# Altium project FIT_PM12_v1.1.PrjPcb (part 8 of 13)

## Sheet JTAG.SchDoc: FIT_PM12 board
size 420 x 297 mm; CheckedBy: G.Kasprowicz; Author: INR Moscow; CompanyName: WUT ISE; DrawnBy: M.Podgórski; Organization: WUT ISE; Address1: PW ISE; Address2: Nowowiejska 15/19 00-665 Warsaw; Address3: gkasprow@gmail.com; DocumentNumber: 25; Revision: 2; SheetNumber: 23; SheetTotal: 34; ModifiedBy: -; CheckedDate: -; Title2: JTAG; DivGrp: WUT ISE; Designer: INR RAS; ModifiedDate: -; ProjectName: Sensor Box
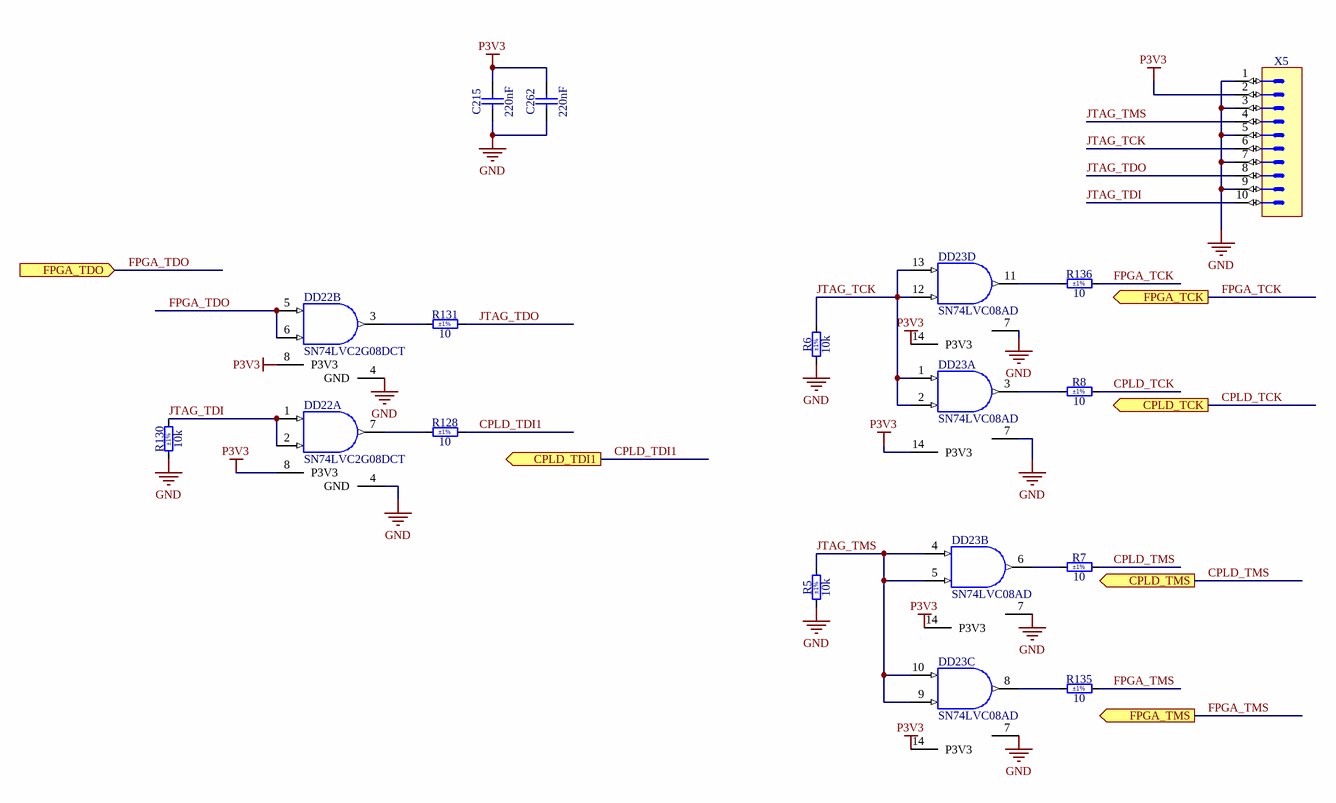
[diagram p25: JTAG.SchDoc]

### Parts
C215  220nF  [CAPC2012X135N]
C262  220nF  [CAPC2012X135N]
DD22  SN74LVC2G08DCT  [SOP65P400X130-8N]  (parts A,B of 2)
DD23  SN74LVC08AD  [SOIC127P600X175-14N]  (parts A,B,C,D of 4)
R5  10k  Tolerance: ±1%  [RESC2012X60N]
R6  10k  Tolerance: ±1%  [RESC2012X60N]
R7  10  Tolerance: ±1%  [RESC2012X70N]
R8  10  Tolerance: ±1%  [RESC2012X70N]
R128  10  Tolerance: ±1%  [RESC2012X70N]
R130  10k  Tolerance: ±1%  [RESC2012X60N]
R131  10  Tolerance: ±1%  [RESC2012X70N]
R135  10  Tolerance: ±1%  [RESC2012X70N]
R136  10  Tolerance: ±1%  [RESC2012X70N]
X5  (no value)  [CONNFLY_DS1014-10SF1B-B]

### Ports
CPLD_TCK (out), CPLD_TDI1 (out), CPLD_TMS (out), FPGA_TCK (out), FPGA_TDO (in), FPGA_TMS (out)

### Nets
GND: C215.1 C262.1 DD22.4(GND) DD23.7(GND) R5.1 R6.1 R130.1 X5.1 X5.3 X5.5 X5.7 X5.9
P3V3: C215.2 C262.2 DD22.8(P3V3) DD23.14(P3V3) X5.2  [also labelled VCC]
CPLD_TCK: R8.2 ; port CPLD_TCK
CPLD_TDI1: R128.2 ; port CPLD_TDI1  [project net CPLD_TDI]
CPLD_TMS: R7.2 ; port CPLD_TMS
FPGA_TCK: R136.2 ; port FPGA_TCK
FPGA_TDO: DD22.5(A) DD22.6(B) ; port FPGA_TDO
FPGA_TMS: R135.2 ; port FPGA_TMS
JTAG_TCK: DD23.1(A) DD23.2(B) DD23.12(B) DD23.13(A) R6.2 X5.6
JTAG_TDI: DD22.1(A) DD22.2(B) R130.2 X5.10
JTAG_TDO: R131.2 X5.8
JTAG_TMS: DD23.4(A) DD23.5(B) DD23.9(B) DD23.10(A) R5.2 X5.4
NetDD22_3: DD22.3(Y) R131.1
NetDD22_7: DD22.7(Y) R128.1
NetDD23_3: DD23.3(Y) R8.1
NetDD23_6: DD23.6(Y) R7.1
NetDD23_8: DD23.8(Y) R135.1
NetDD23_11: DD23.11(Y) R136.1

### Notes on the sheet
- Project/Equipment
- Document
- Designer
- Drawn by
- Check.by
- Copyright WUT ISE 2024.
  This documentation describes Open Hardware and is licensed under the CERN OHL v.2. You may redistribute and modify this documentation under the terms of the CERN OHL v.2. (http://ohwr.org/CERNOHL). This documentation is distributed WITHOUT ANY EXPRESS OR IMPLIED WARRANTY, INCLUDING OF MERCHANTABILITY, SATISFACTORY QUALITY AND FITNESS FOR A PARTICULAR PURPOSE. Please see the CERN OHL v.2 for applicable conditions.
- Contact
- File
- Last Mod.
- Print Date
- Sheet
- Size
- A3
- of
- Rev

### Library data of the parts
C215 C262 = CC0805_220NF_50V_10%_X7R: Non-polarised capacitor; Part Description: SMD Multilayer Chip Ceramic Capacitor; Manufacturer: GENERIC; Manufacturer1 Part Number: GRM21BR71H224KA01L; Voltage: 50V; TC: X7R; Tolerance: ±10%; Part Number: CC0805_220NF_50V_10%_X7R; Component Kind: Standard; Component Type: Standard; Pin Count: 2; Value: 220nF; Status: Preferred; Manufacturer Part Number: CC0805_220NF_50V_10%_X7R; Case: 0805; Mounted: Yes; Socket: No; SMD: Yes; Sense: No; Manufacturer1 Example: MURATA; Manufacturer1 ComponentHeight: 1.35mm; HelpURL: \\cern.ch\dfs\Applications\Altium\Datasheets\CC0805_X7R_MURATA.pdf; Author: CERN DEM JLC; CreateDate: 03.12.2007; LatestRevisionDate: 03.12.2007
DD22 = SN74LVC2G08DCT: Dual 2-Input Positive AND Gate; Part Description: Dual 2-Input Positive-AND Gate; Manufacturer: TEXAS INSTRUMENTS; PressFit: No; Bonding: No; Part Number: SN74LVC2G08DCT; Component Kind: Standard; Component Type: Standard; Device: SN74LVC2G08DCT; PackageDescription: SOP, 0.65mm Pitch; 8 Pin, 2.80mm W X 2.95mm L X 1.30mm H body, IPC Medium Density; Manufacturer Part Number: SN74LVC2G08DCT; Pin Count: 8; Case: TSSOP8; Mounted: Yes; Socket: No; SMD: Yes; Sense: No; ComponentHeight: 1.3mm; Author: CERN DEM MR; HelpURL: \\cern.ch\dfs\Applications\Altium\Datasheets\SN74LVC2G08DCT.pdf; CreateDate: 10.03.2017; LatestRevisionDate: 10.03.2017
DD23 = SN74LVC08AD: Quad 2-Input AND Gate; Part Description: Quadruple 2-Input Positive-AND Gate; Manufacturer: TEXAS INSTRUMENTS; PressFit: No; Bonding: No; Part Number: SN74LVC08AD; Component Kind: Standard; Component Type: Standard; Device: SN74LVC08AD; PackageDescription: SOIC 14, Pitch 1.27mm - Body 4x8.75mm, IPC Medium Density; Manufacturer Part Number: SN74LVC08AD; Pin Count: 14; Case: SOIC14; Mounted: Yes; Socket: No; SMD: Yes; Sense: No; ComponentHeight: 1.75mm; Author: CERN DEM JLC; HelpURL: \\cern.ch\dfs\Applications\Altium\Datasheets\SN74LVC08AD.pdf; CreateDate: 21.03.2012; LatestRevisionDate: 21.03.2012
R5 R6 R130 = R0805_10K_1%_0.125W_100PPM: Resistor - 1%; Part Description: General Purpose Thick Film Chip Resistor; Manufacturer: GENERIC; Manufacturer1 Part Number: NRC10F1002TRF; Power: 0.125W; TC: ±100ppm/°C; PressFit: No; Part Number: R0805_10K_1%_0.125W_100PPM; Component Kind: Standard; Component Type: Standard; Pin Count: 2; Value: 10k; Status: Preferred; Manufacturer Part Number: R0805_10K_1%_0.125W_100PPM; Case: 0805; Mounted: Yes; Sense: No; Socket: No; SMD: Yes; Manufacturer1 Example: NIC COMPONENT; Manufacturer1 ComponentHeight: 0.6mm; HelpURL: \\cern.ch\dfs\Applications\Altium\Datasheets\R0805_NIC_NRC.pdf; Author: CERN DEM JLC; CreateDate: 03.12.2007; LatestRevisionDate: 13.03.2008
R7 R8 R128 R131 R135 R136 = R0805_10R_1%_0.125W_100PPM_PANASONIC_ERJ: Resistor - 1%; Part Description: Low Resistance Thick Film Chip Resistor; Manufacturer Part Number: ERJ6ENF10R0V; Power: 0.125W; TC: ±100ppm/°C; PressFit: No; Part Number: R0805_10R_1%_0.125W_100PPM_PANASONIC_ERJ; Component Kind: Standard; Component Type: Standard; Pin Count: 2; Value: 10; Status: None; Manufacturer: PANASONIC; Case: 0805; Mounted: Yes; Sense: No; Socket: No; SMD: Yes; ComponentHeight: 0.7mm; HelpURL: \\cern.ch\dfs\Applications\Altium\Datasheets\R0805_PANASONIC_ERJ6EN.pdf; Author: CERN DEM HF; CreateDate: 07.06.2024; LatestRevisionDate: 07.06.2024
X5 = CONNFLY_DS1014-10SF1B-B: Connector 10 Male; Part Description: 10 Contacts, 2.00mm Box Header V/T,R/A & SMT Type; PressFit: No; Part Number: CONNFLY_DS1014-10SF1B-B; Component Kind: Standard; Component Type: Standard; Pin Count: 10; Mounted: Yes; Socket: No; SMD: No; Sense: No; Status: None; Manufacturer: CONNFLY; Manufacturer Part Number: DS1014-10SF1B-B; ComponentHeight: 5.6mm; HelpURL: \\cern.ch\dfs\Applications\Altium\Datasheets\CONNFLY_DS1014-10SF1B-B.pdf; Author: CERN DEM HF; CreateDate: 29.05.2024; LatestRevisionDate: 29.05.2024

## Sheet FPGA_Power.SchDoc: FIT_PM12 board
size 420 x 297 mm; CheckedBy: G.Kasprowicz; Author: INR Moscow; CompanyName: WUT ISE; DrawnBy: M.Podgórski; Organization: WUT ISE; Address1: PW ISE; Address2: Nowowiejska 15/19 00-665 Warsaw; Address3: gkasprow@gmail.com; DocumentNumber: 26; Revision: 2; SheetNumber: 24; SheetTotal: 34; ModifiedBy: -; CheckedDate: -; Title2: FPGA PWR; DivGrp: WUT ISE; Designer: INR RAS; ModifiedDate: -; ProjectName: Sensor Box
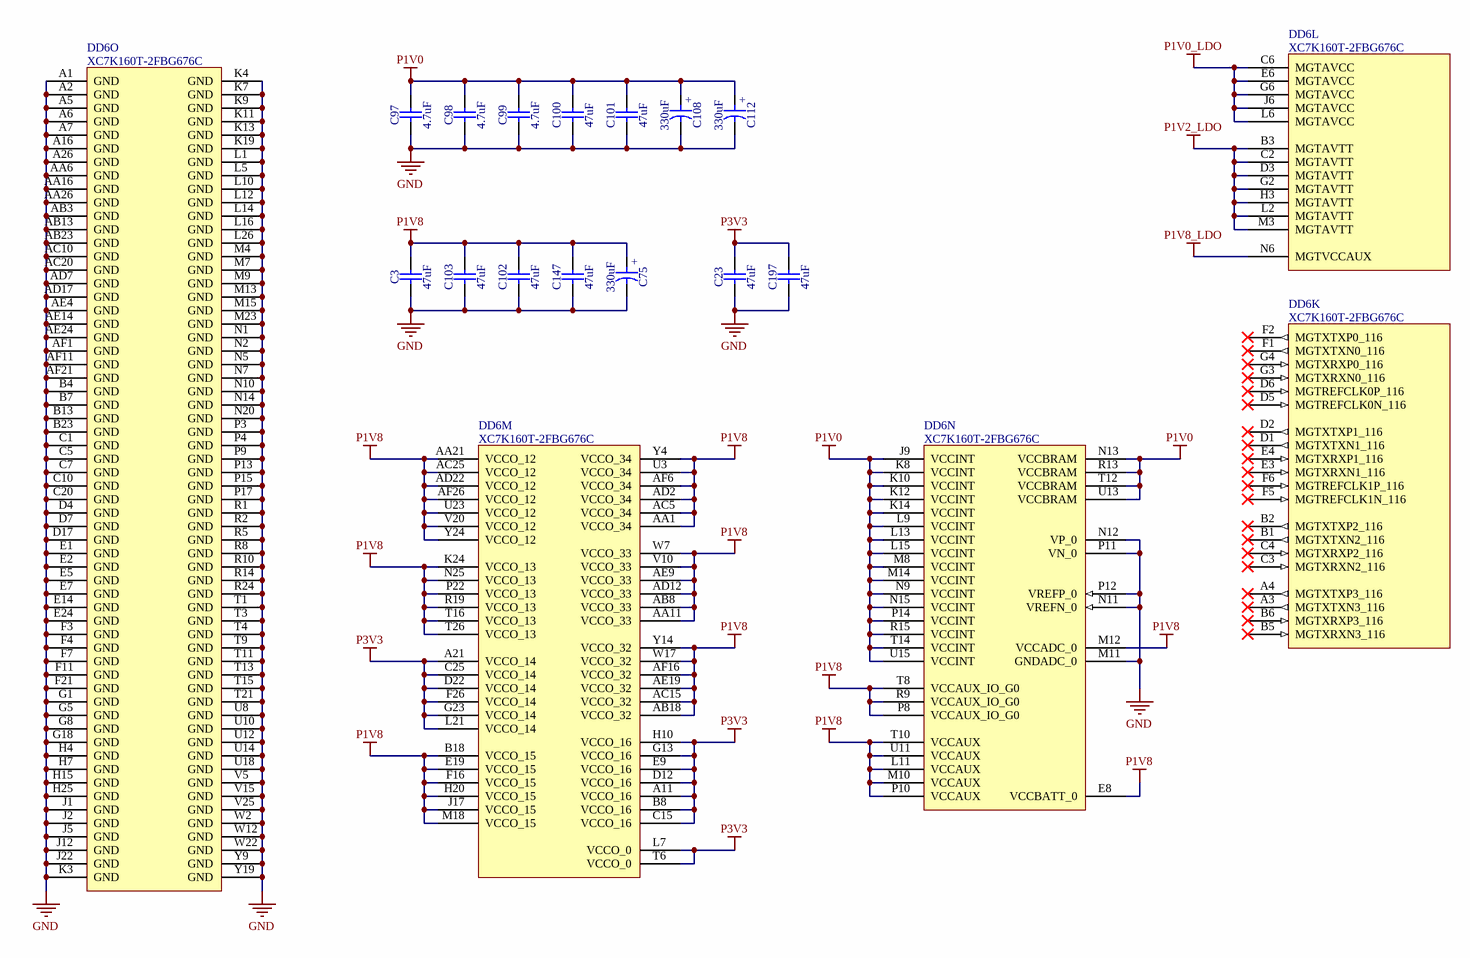
[diagram p26: FPGA_Power.SchDoc]

### Parts
C3  47uF  [CAPC3225X270N]
C23  47uF  [CAPC3225X270N]
C75  330uF  [CAPMP7343X300N]
C97  4.7uF  [CAPC2012X145N]
C98  4.7uF  [CAPC2012X145N]
C99  4.7uF  [CAPC2012X145N]
C100  47uF  [CAPC3225X270N]
C101  47uF  [CAPC3225X270N]
C102  47uF  [CAPC3225X270N]
C103  47uF  [CAPC3225X270N]
C108  330uF  [CAPMP7343X190N]
C112  330uF  [CAPMP7343X190N]
C147  47uF  [CAPC3225X270N]
C197  47uF  [CAPC3225X270N]
DD6  XC7K160T-2FBG676C  [BGA676C100P26X26_2700X2700X254]  (parts K,L,M,N,O of 15)

### Nets
GND: C3.1 C23.1 C75.2 C97.1 C98.1 C99.1 C100.1 C101.1 C102.1 C103.1 C108.2 C112.2 C147.1 C197.1 DD6.A1(GND) DD6.A2(GND) DD6.A5(GND) DD6.A6(GND) DD6.A7(GND) DD6.A16(GND) DD6.A26(GND) DD6.AA6(GND) DD6.AA16(GND) DD6.AA26(GND) DD6.AB3(GND) DD6.AB13(GND) DD6.AB23(GND) DD6.AC10(GND) DD6.AC20(GND) DD6.AD7(GND) DD6.AD17(GND) DD6.AE4(GND) DD6.AE14(GND) DD6.AE24(GND) DD6.AF1(GND) DD6.AF11(GND) DD6.AF21(GND) DD6.B4(GND) DD6.B7(GND) DD6.B13(GND) DD6.B23(GND) DD6.C1(GND) DD6.C5(GND) DD6.C7(GND) DD6.C10(GND) DD6.C20(GND) DD6.D4(GND) DD6.D7(GND) DD6.D17(GND) DD6.E1(GND) DD6.E2(GND) DD6.E5(GND) DD6.E7(GND) DD6.E14(GND) DD6.E24(GND) DD6.F3(GND) DD6.F4(GND) DD6.F7(GND) DD6.F11(GND) DD6.F21(GND) DD6.G1(GND) DD6.G5(GND) DD6.G8(GND) DD6.G18(GND) DD6.H4(GND) DD6.H7(GND) DD6.H15(GND) DD6.H25(GND) DD6.J1(GND) DD6.J2(GND) DD6.J5(GND) DD6.J12(GND) DD6.J22(GND) DD6.K3(GND) DD6.K4(GND) DD6.K7(GND) DD6.K9(GND) DD6.K11(GND) DD6.K13(GND) DD6.K19(GND) DD6.L1(GND) DD6.L5(GND) DD6.L10(GND) DD6.L12(GND) DD6.L14(GND) DD6.L16(GND) DD6.L26(GND) DD6.M4(GND) DD6.M7(GND) DD6.M9(GND) DD6.M11(GNDADC_0) DD6.M13(GND) DD6.M15(GND) DD6.M23(GND) DD6.N1(GND) DD6.N2(GND) DD6.N5(GND) DD6.N7(GND) DD6.N10(GND) DD6.N11(VREFN_0) DD6.N12(VP_0) DD6.N14(GND) DD6.N20(GND) DD6.P3(GND) DD6.P4(GND) DD6.P9(GND) DD6.P11(VN_0) DD6.P12(VREFP_0) DD6.P13(GND) DD6.P15(GND) DD6.P17(GND) DD6.R1(GND) DD6.R2(GND) DD6.R5(GND) DD6.R8(GND) DD6.R10(GND) DD6.R14(GND) DD6.R24(GND) DD6.T1(GND) DD6.T3(GND) DD6.T4(GND) DD6.T9(GND) DD6.T11(GND) DD6.T13(GND) DD6.T15(GND) DD6.T21(GND) DD6.U8(GND) DD6.U10(GND) DD6.U12(GND) DD6.U14(GND) DD6.U18(GND) DD6.V5(GND) DD6.V15(GND) DD6.V25(GND) DD6.W2(GND) DD6.W12(GND) DD6.W22(GND) DD6.Y9(GND) DD6.Y19(GND)
P1V0: C97.2 C98.2 C99.2 C100.2 C101.2 C108.1 C112.1 DD6.J9(VCCINT) DD6.K8(VCCINT) DD6.K10(VCCINT) DD6.K12(VCCINT) DD6.K14(VCCINT) DD6.L9(VCCINT) DD6.L13(VCCINT) DD6.L15(VCCINT) DD6.M8(VCCINT) DD6.M14(VCCINT) DD6.N9(VCCINT) DD6.N13(VCCBRAM) DD6.N15(VCCINT) DD6.P14(VCCINT) DD6.R13(VCCBRAM) DD6.R15(VCCINT) DD6.T12(VCCBRAM) DD6.T14(VCCINT) DD6.U13(VCCBRAM) DD6.U15(VCCINT)
P1V0_LDO: DD6.C6(MGTAVCC) DD6.E6(MGTAVCC) DD6.G6(MGTAVCC) DD6.J6(MGTAVCC) DD6.L6(MGTAVCC)
P1V2_LDO: DD6.B3(MGTAVTT) DD6.C2(MGTAVTT) DD6.D3(MGTAVTT) DD6.G2(MGTAVTT) DD6.H3(MGTAVTT) DD6.L2(MGTAVTT) DD6.M3(MGTAVTT)
P1V8: C3.2 C75.1 C102.2 C103.2 C147.2 DD6.AA1(VCCO_34) DD6.AA11(VCCO_33) DD6.AA21(VCCO_12) DD6.AB8(VCCO_33) DD6.AB18(VCCO_32) DD6.AC5(VCCO_34) DD6.AC15(VCCO_32) DD6.AC25(VCCO_12) DD6.AD2(VCCO_34) DD6.AD12(VCCO_33) DD6.AD22(VCCO_12) DD6.AE9(VCCO_33) DD6.AE19(VCCO_32) DD6.AF6(VCCO_34) DD6.AF16(VCCO_32) DD6.AF26(VCCO_12) DD6.B18(VCCO_15) DD6.E8(VCCBATT_0) DD6.E19(VCCO_15) DD6.F16(VCCO_15) DD6.H20(VCCO_15) DD6.J17(VCCO_15) DD6.K24(VCCO_13) DD6.L11(VCCAUX) DD6.M10(VCCAUX) DD6.M12(VCCADC_0) DD6.M18(VCCO_15) DD6.N25(VCCO_13) DD6.P8(VCCAUX_IO_G0) DD6.P10(VCCAUX) DD6.P22(VCCO_13) DD6.R9(VCCAUX_IO_G0) DD6.R19(VCCO_13) DD6.T8(VCCAUX_IO_G0) DD6.T10(VCCAUX) DD6.T16(VCCO_13) DD6.T26(VCCO_13) DD6.U3(VCCO_34) DD6.U11(VCCAUX) DD6.U23(VCCO_12) DD6.V10(VCCO_33) DD6.V20(VCCO_12) DD6.W7(VCCO_33) DD6.W17(VCCO_32) DD6.Y4(VCCO_34) DD6.Y14(VCCO_32) DD6.Y24(VCCO_12)
P1V8_LDO: DD6.N6(MGTVCCAUX)
P3V3: C23.2 C197.2 DD6.A11(VCCO_16) DD6.A21(VCCO_14) DD6.B8(VCCO_16) DD6.C15(VCCO_16) DD6.C25(VCCO_14) DD6.D12(VCCO_16) DD6.D22(VCCO_14) DD6.E9(VCCO_16) DD6.F26(VCCO_14) DD6.G13(VCCO_16) DD6.G23(VCCO_14) DD6.H10(VCCO_16) DD6.L7(VCCO_0) DD6.L21(VCCO_14) DD6.T6(VCCO_0)

Not connected (* = marked no-connect by the designer): DD6 A3(MGTXTXN3_116)* A4(MGTXTXP3_116)* B1(MGTXTXN2_116)* B2(MGTXTXP2_116)* B5(MGTXRXN3_116)* B6(MGTXRXP3_116)* C3(MGTXRXN2_116)* C4(MGTXRXP2_116)* D1(MGTXTXN1_116)* D2(MGTXTXP1_116)* D5(MGTREFCLK0N_116)* D6(MGTREFCLK0P_116)* E3(MGTXRXN1_116)* E4(MGTXRXP1_116)* F1(MGTXTXN0_116)* F2(MGTXTXP0_116)* F5(MGTREFCLK1N_116)* F6(MGTREFCLK1P_116)* G3(MGTXRXN0_116)* G4(MGTXRXP0_116)*

### Notes on the sheet
- Project/Equipment
- Document
- Designer
- Drawn by
- Check.by
- Copyright WUT ISE 2024.
  This documentation describes Open Hardware and is licensed under the CERN OHL v.2. You may redistribute and modify this documentation under the terms of the CERN OHL v.2. (http://ohwr.org/CERNOHL). This documentation is distributed WITHOUT ANY EXPRESS OR IMPLIED WARRANTY, INCLUDING OF MERCHANTABILITY, SATISFACTORY QUALITY AND FITNESS FOR A PARTICULAR PURPOSE. Please see the CERN OHL v.2 for applicable conditions.
- Contact
- File
- Last Mod.
- Print Date
- Sheet
- Size
- A3
- of
- Rev
- (in symbol CTE7343-19_330UF_2.5V_20%_LESR0009_KEMET_T520) +
- (in symbol CTE7343-30_330UF_4V_20%_PANASONIC_TPF) +

### Library data of the parts
C3 C23 C100-C103 C147 C197 = CC1210_47UF_16V_20%_X5R: Non-polarised capacitor; Part Description: SMD Multilayer Chip Ceramic Capacitor; Manufacturer: GENERIC; Manufacturer1 Part Number: EMK325BJ476MM-T; Voltage: 16V; TC: X5R; Tolerance: ±20%; Part Number: CC1210_47UF_16V_20%_X5R; Component Kind: Standard; Component Type: Standard; Pin Count: 2; Value: 47uF; Status: None; Manufacturer Part Number: CC1210_47UF_16V_20%_X5R; Case: 1210; Mounted: Yes; Socket: No; SMD: Yes; Sense: No; Manufacturer1 Example: TAIYO YUDEN; Manufacturer1 ComponentHeight: 2.7mm; HelpURL: \\cern.ch\dfs\Applications\Altium\Datasheets\CC1210_X5R_TAIYO-YUDEN_HIGH-VALUE.pdf; Author: CERN DEM MR; CreateDate: 03.02.2016; LatestRevisionDate: 03.02.2016
C75 = CTE7343-30_330UF_4V_20%_PANASONIC_TPF: Polarised capacitor; Part Description: ESR 0R009 Tantalum Chip Capacitor; Manufacturer Part Number: 4TPF330M9L; Voltage: 4V; Tolerance: ±20%; Part Number: CTE7343-30_330UF_4V_20%_PANASONIC_TPF; Component Kind: Standard; Component Type: Standard; Pin Count: 2; Value: 330uF; Status: None; Manufacturer: PANASONIC; Mounted: Yes; Socket: No; SMD: Yes; Sense: No; ComponentHeight: 3mm; HelpURL: \\cern.ch\dfs\Applications\Altium\Datasheets\CTE_PANASONIC_TPF.pdf; Author: CERN DEM HF; CreateDate: 30.05.2024; LatestRevisionDate: 30.05.2024
C97-C99 = CC0805_4.7UF_50V_10%_X7R: Non-polarised capacitor; Part Description: SMD Multilayer Chip Ceramic Capacitor; Manufacturer: GENERIC; Manufacturer1 Part Number: C2012X7R1H475K125; Voltage: 50V; TC: X7R; Tolerance: ±10%; Part Number: CC0805_4.7UF_50V_10%_X7R; Component Kind: Standard; Component Type: Standard; Pin Count: 2; Value: 4.7uF; Status: Preferred; Manufacturer Part Number: CC0805_4.7UF_50V_10%_X7R; Case: 0805; Mounted: Yes; Socket: No; SMD: Yes; Sense: No; Manufacturer1 Example: TDK; Manufacturer1 ComponentHeight: 1.45mm; HelpURL: \\cern.ch\dfs\Applications\Altium\Datasheets\CC0805_X7R_TDK_C.pdf; Author: CERN DEM JMW; CreateDate: 30.07.2021; LatestRevisionDate: 30.07.2021
C108 C112 = CTE7343-19_330UF_2.5V_20%_LESR0009_KEMET_T520: Polarised capacitor; Part Description: Low ESR 0R009 Tantalum Chip Capacitor; Manufacturer: KEMET; Manufacturer Part Number: T520V337M2R5ATE009; Voltage: 2.5V; Tolerance: ±20%; Part Number: CTE7343-19_330UF_2.5V_20%_LESR0009_KEMET_T520; Component Kind: Standard; Component Type: Standard; Pin Count: 2; Value: 330uF; Status: None; Case: V; Mounted: Yes; Socket: No; SMD: Yes; Sense: No; ComponentHeight: 1.9mm; HelpURL: \\cern.ch\dfs\Applications\Altium\Datasheets\CTE-LESR_KEMET_T520.pdf; Author: CERN DEM HF; CreateDate: 30.05.2024; LatestRevisionDate: 30.05.2024
DD6 = XC7K160T-2FBG676C: KINTEX-7, FPGA, 676-Ball BGA, Pb-Free; Part Description: KINTEX-7 FPGA, 162240 Logic Cells, 400 User I/O, 8 GTXs, 676-Ball BGA, Speed Grade 2, Commercial Grade, Pb-Free; Manufacturer: XILINX; PressFit: No; Bonding: No; Part Number: XC7K160T-2FBG676C; Component Kind: Standard; Component Type: Standard; Device: XC7K160T-2FBG676C; PackageDescription: BGA, 1.00mm Pitch, Square; 676 Pin, 26 Columns X 26 Rows, Body 27.0mm X 27.0mm X 2.54mm H, IPC Medium Density; Manufacturer Part Number: XC7K160T-2FBG676C; Pin Count: 676; Case: BGA676; Mounted: Yes; Socket: No; SMD: Yes; Sense: No; ComponentHeight: 2.54mm; HelpURL: \\cern.ch\dfs\Applications\Altium\Datasheets\XC7K160T-xFBG676C.pdf; ComponentLink1URL: \\cern.ch\dfs\Applications\Altium\Datasheets\XC7K160T-xFBG676C_Package-Pinout.pdf; ComponentLink1Description: Package/Pinout; Author: CERN DEM BC; CreateDate: 06.02.2020; LatestRevisionDate: 06.02.2020

## Sheet AFE.SchDoc: FIT_PM12 board
size 420 x 297 mm; CheckedBy: G.Kasprowicz; Author: INR Moscow; CompanyName: WUT ISE; DrawnBy: M.Podgórski; Organization: WUT ISE; Address1: PW ISE; Address2: Nowowiejska 15/19 00-665 Warsaw; Address3: gkasprow@gmail.com; DocumentNumber: 2; Revision: 2; SheetNumber: 6; SheetTotal: 34; ModifiedBy: -; CheckedDate: -; Title2: AFEs; DivGrp: WUT ISE; Designer: INR RAS; ModifiedDate: -; ProjectName: Sensor Box
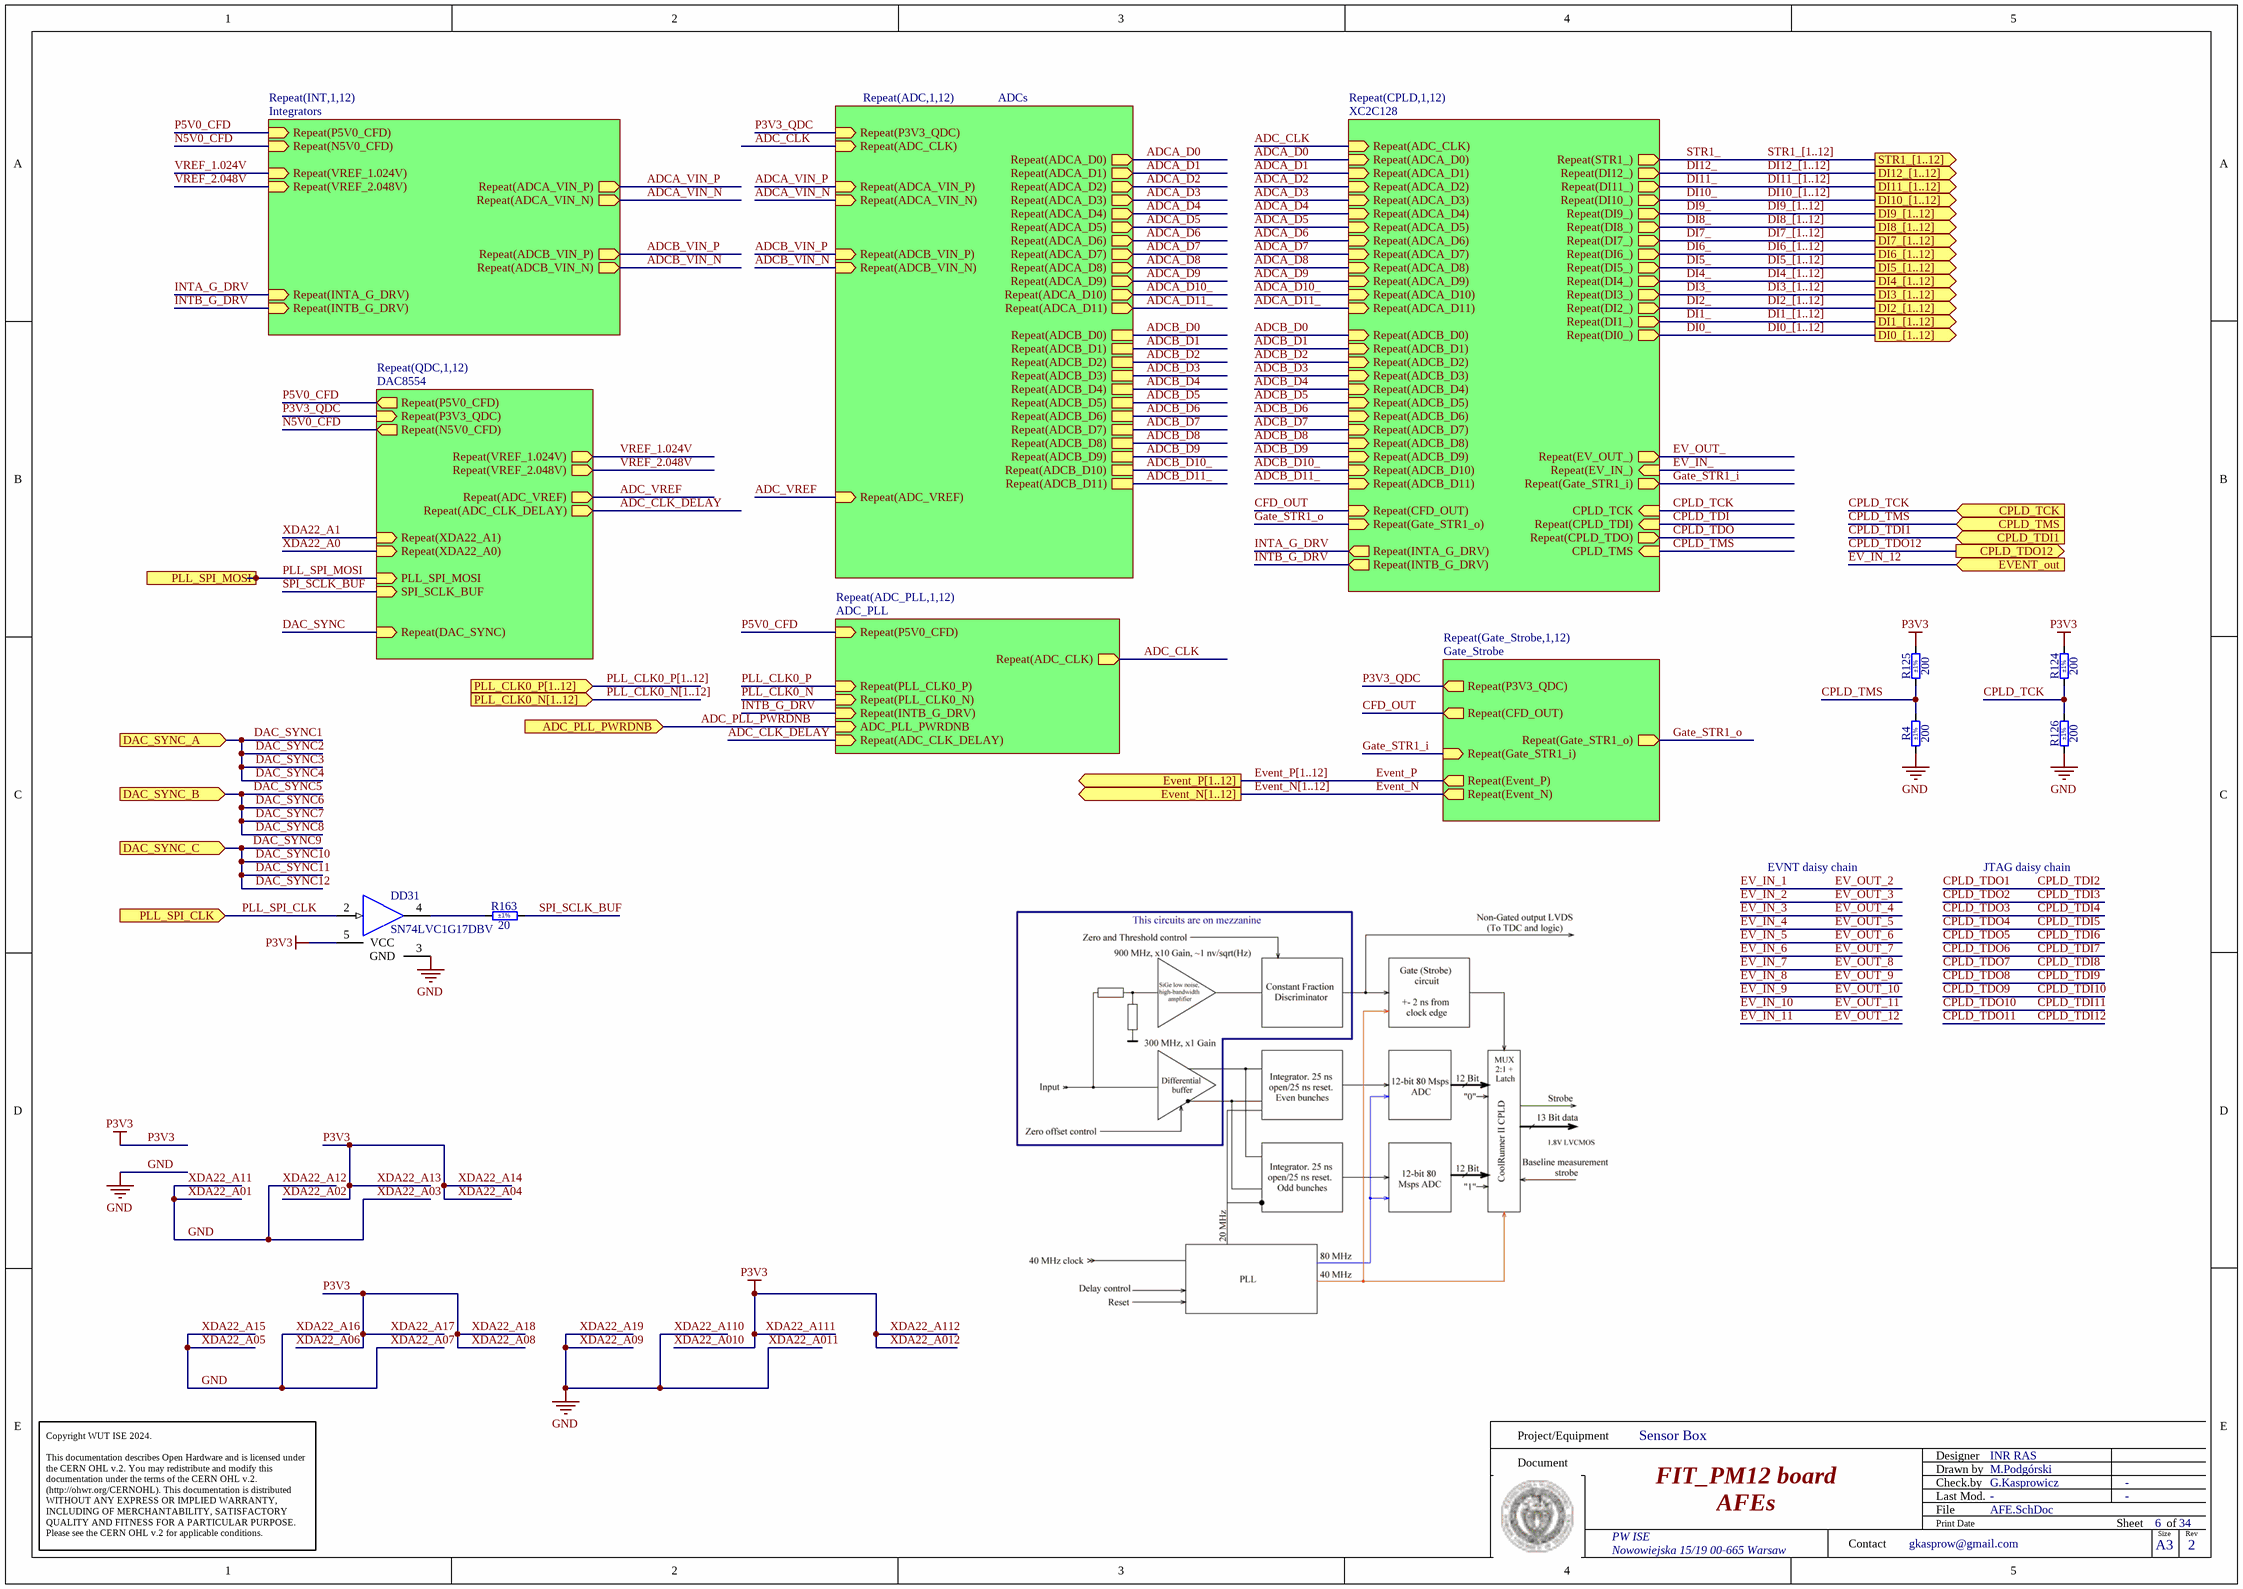
[diagram p27: AFE.SchDoc]

### Parts
(Parts that share a designator on the sheet are numbered #1, #2 ... from top to bottom, then left to right.)
DD31  SN74LVC1G17DBV  [SOT95P280X145-5N]
R4  200  Tolerance: ±1%  [RESC2012X60N]
R124#1  200  Tolerance: ±1%  [RESC2012X60N]
R125#1  200  Tolerance: ±1%  [RESC2012X60N]
R126#1  200  Tolerance: ±1%  [RESC2012X60N]
R163#1  20  Tolerance: ±1%  [RESC2012X60N]

### Sub-sheets
Repeat(ADC,1,12) = ADCs: Repeat(P3V3_QDC) (in), Repeat(ADCA_VIN_N) (in), Repeat(ADCA_VIN_P) (in), Repeat(ADC_VREF) (in), Repeat(ADCA_D6) (out), Repeat(ADCA_D5) (out), Repeat(ADCA_D4) (out), Repeat(ADCA_D3) (out), Repeat(ADCA_D2) (out), Repeat(ADCA_D1) (out), Repeat(ADCA_D0) (out), Repeat(ADCA_D8) (out), Repeat(ADCA_D7) (out), Repeat(ADCA_D10) (out), Repeat(ADCA_D9) (out), Repeat(ADCA_D11) (out), Repeat(ADCB_D11), Repeat(ADCB_D9), Repeat(ADCB_D8), Repeat(ADCB_D0), Repeat(ADCB_D1), Repeat(ADCB_D2), Repeat(ADCB_D3), Repeat(ADCB_D4), Repeat(ADCB_D5), Repeat(ADCB_D6), Repeat(ADCB_D7), Repeat(ADC_CLK) (in), Repeat(ADCB_VIN_N) (in), Repeat(ADCB_D10), Repeat(ADCB_VIN_P) (in)
Repeat(ADC_PLL,1,12) = ADC_PLL: Repeat(PLL_CLK0_P) (in), Repeat(PLL_CLK0_N) (in), ADC_PLL_PWRDNB (in), Repeat(ADC_CLK_DELAY) (in), Repeat(P5V0_CFD) (in), Repeat(ADC_CLK) (out), Repeat(INTB_G_DRV) (in)
Repeat(CPLD,1,12) = XC2C128: Repeat(INTA_G_DRV) (out), Repeat(INTB_G_DRV) (out), Repeat(ADC_CLK) (in), Repeat(Gate_STR1_i) (out), Repeat(Gate_STR1_o) (in), Repeat(CFD_OUT) (in), Repeat(CPLD_TDI) (in), Repeat(DI0_) (out), Repeat(DI1_) (out), Repeat(DI2_) (out), Repeat(DI3_) (out), Repeat(DI4_) (out), Repeat(DI5_) (out), Repeat(DI6_) (out), Repeat(DI7_) (out), Repeat(DI8_) (out), Repeat(STR1_) (out), Repeat(DI12_) (out), Repeat(DI11_) (out), Repeat(DI10_) (out), Repeat(DI9_) (out), Repeat(ADCA_D6) (in), Repeat(ADCA_D5) (in), Repeat(ADCA_D4) (in), Repeat(ADCA_D3) (in), Repeat(ADCA_D2) (in), Repeat(ADCA_D1) (in), Repeat(ADCA_D0) (in), Repeat(ADCB_D11) (in), Repeat(ADCB_D10) (in), Repeat(ADCB_D9) (in), Repeat(ADCB_D8) (in), Repeat(ADCA_D8) (in), Repeat(ADCA_D7) (in), Repeat(ADCA_D10) (in), Repeat(ADCA_D9) (in), Repeat(EV_OUT_) (out), Repeat(ADCA_D11) (in), Repeat(ADCB_D0) (in), Repeat(ADCB_D1) (in), Repeat(ADCB_D2) (in), Repeat(ADCB_D3) (in), Repeat(ADCB_D4) (in), Repeat(ADCB_D5) (in), Repeat(ADCB_D6) (in), Repeat(ADCB_D7) (in), Repeat(EV_IN_) (in), Repeat(CPLD_TDO) (out), CPLD_TCK (in), CPLD_TMS (in)
Repeat(Gate_Strobe,1,12) = Gate_Strobe: Repeat(Gate_STR1_i) (in), Repeat(Event_P) (out), Repeat(Event_N) (out), Repeat(P3V3_QDC) (out), Repeat(Gate_STR1_o) (out), Repeat(CFD_OUT) (out)
Repeat(INT,1,12) = Integrators: Repeat(N5V0_CFD) (in), Repeat(P5V0_CFD) (in), Repeat(INTA_G_DRV) (in), Repeat(INTB_G_DRV) (in), Repeat(VREF_2.048V) (in), Repeat(VREF_1.024V) (in), Repeat(ADCA_VIN_P) (out), Repeat(ADCA_VIN_N) (out), Repeat(ADCB_VIN_P) (out), Repeat(ADCB_VIN_N) (out)
Repeat(QDC,1,12) = DAC8554: Repeat(ADC_CLK_DELAY) (out), PLL_SPI_MOSI (in), SPI_SCLK_BUF (in), Repeat(DAC_SYNC) (in), Repeat(P5V0_CFD) (out), Repeat(N5V0_CFD) (out), Repeat(P3V3_QDC) (in), Repeat(VREF_2.048V) (out), Repeat(VREF_1.024V) (out), Repeat(ADC_VREF) (out), Repeat(XDA22_A1) (in), Repeat(XDA22_A0) (in)

### Ports
ADC_PLL_PWRDNB (in), CPLD_TCK (in), CPLD_TDI1 (in), CPLD_TDO12 (out), CPLD_TMS (in), DAC_SYNC_A (in), DAC_SYNC_B (in), DAC_SYNC_C (in), DI0_[1..12] (out), DI1_[1..12] (out), DI2_[1..12] (out), DI3_[1..12] (out), DI4_[1..12] (out), DI5_[1..12] (out), DI6_[1..12] (out), DI7_[1..12] (out), DI8_[1..12] (out), DI9_[1..12] (out), DI10_[1..12] (out), DI11_[1..12] (out), DI12_[1..12] (out), Event_N[1..12] (out), EVENT_out (in), Event_P[1..12] (out), PLL_CLK0_N[1..12] (in), PLL_CLK0_P[1..12] (in), PLL_SPI_CLK (in), PLL_SPI_MOSI (in), STR1_[1..12] (out)

### Nets
GND: DD31.3(GND) R4.1 R126#1.1  [also labelled XDA22_A01, XDA22_A011, XDA22_A03, XDA22_A05, XDA22_A07, XDA22_A09, XDA22_A11, XDA22_A110, XDA22_A12, XDA22_A15, XDA22_A16, XDA22_A19]
P3V3: DD31.5(VCC) R124#1.2 R125#1.2  [also labelled XDA22_A010, XDA22_A012, XDA22_A02, XDA22_A04, XDA22_A06, XDA22_A08, XDA22_A111, XDA22_A112, XDA22_A13, XDA22_A14, XDA22_A17, XDA22_A18]
ADC_CLK: sheet Repeat(ADC,1,12)/Repeat(ADC_CLK), sheet Repeat(CPLD,1,12)/Repeat(ADC_CLK), sheet Repeat(ADC_PLL,1,12)/Repeat(ADC_CLK)
ADC_CLK_DELAY: sheet Repeat(QDC,1,12)/Repeat(ADC_CLK_DELAY), sheet Repeat(ADC_PLL,1,12)/Repeat(ADC_CLK_DELAY)
ADC_PLL_PWRDNB: port ADC_PLL_PWRDNB, sheet Repeat(ADC_PLL,1,12)/ADC_PLL_PWRDNB
ADC_VREF: sheet Repeat(ADC,1,12)/Repeat(ADC_VREF), sheet Repeat(QDC,1,12)/Repeat(ADC_VREF)
ADCA_D0: sheet Repeat(ADC,1,12)/Repeat(ADCA_D0), sheet Repeat(CPLD,1,12)/Repeat(ADCA_D0)
ADCA_D1: sheet Repeat(ADC,1,12)/Repeat(ADCA_D1), sheet Repeat(CPLD,1,12)/Repeat(ADCA_D1)
ADCA_D2: sheet Repeat(ADC,1,12)/Repeat(ADCA_D2), sheet Repeat(CPLD,1,12)/Repeat(ADCA_D2)
ADCA_D3: sheet Repeat(ADC,1,12)/Repeat(ADCA_D3), sheet Repeat(CPLD,1,12)/Repeat(ADCA_D3)
ADCA_D4: sheet Repeat(ADC,1,12)/Repeat(ADCA_D4), sheet Repeat(CPLD,1,12)/Repeat(ADCA_D4)
ADCA_D5: sheet Repeat(ADC,1,12)/Repeat(ADCA_D5), sheet Repeat(CPLD,1,12)/Repeat(ADCA_D5)
ADCA_D6: sheet Repeat(ADC,1,12)/Repeat(ADCA_D6), sheet Repeat(CPLD,1,12)/Repeat(ADCA_D6)
ADCA_D7: sheet Repeat(ADC,1,12)/Repeat(ADCA_D7), sheet Repeat(CPLD,1,12)/Repeat(ADCA_D7)
ADCA_D8: sheet Repeat(ADC,1,12)/Repeat(ADCA_D8), sheet Repeat(CPLD,1,12)/Repeat(ADCA_D8)
ADCA_D9: sheet Repeat(ADC,1,12)/Repeat(ADCA_D9), sheet Repeat(CPLD,1,12)/Repeat(ADCA_D9)
ADCA_D10_: sheet Repeat(ADC,1,12)/Repeat(ADCA_D10), sheet Repeat(CPLD,1,12)/Repeat(ADCA_D10)
ADCA_D11_: sheet Repeat(ADC,1,12)/Repeat(ADCA_D11), sheet Repeat(CPLD,1,12)/Repeat(ADCA_D11)
ADCA_VIN_N: sheet Repeat(INT,1,12)/Repeat(ADCA_VIN_N), sheet Repeat(ADC,1,12)/Repeat(ADCA_VIN_N)
ADCA_VIN_P: sheet Repeat(INT,1,12)/Repeat(ADCA_VIN_P), sheet Repeat(ADC,1,12)/Repeat(ADCA_VIN_P)
ADCB_D0: sheet Repeat(ADC,1,12)/Repeat(ADCB_D0), sheet Repeat(CPLD,1,12)/Repeat(ADCB_D0)
ADCB_D1: sheet Repeat(ADC,1,12)/Repeat(ADCB_D1), sheet Repeat(CPLD,1,12)/Repeat(ADCB_D1)
ADCB_D2: sheet Repeat(ADC,1,12)/Repeat(ADCB_D2), sheet Repeat(CPLD,1,12)/Repeat(ADCB_D2)
ADCB_D3: sheet Repeat(ADC,1,12)/Repeat(ADCB_D3), sheet Repeat(CPLD,1,12)/Repeat(ADCB_D3)
ADCB_D4: sheet Repeat(ADC,1,12)/Repeat(ADCB_D4), sheet Repeat(CPLD,1,12)/Repeat(ADCB_D4)
ADCB_D5: sheet Repeat(ADC,1,12)/Repeat(ADCB_D5), sheet Repeat(CPLD,1,12)/Repeat(ADCB_D5)
ADCB_D6: sheet Repeat(ADC,1,12)/Repeat(ADCB_D6), sheet Repeat(CPLD,1,12)/Repeat(ADCB_D6)
ADCB_D7: sheet Repeat(ADC,1,12)/Repeat(ADCB_D7), sheet Repeat(CPLD,1,12)/Repeat(ADCB_D7)
ADCB_D8: sheet Repeat(ADC,1,12)/Repeat(ADCB_D8), sheet Repeat(CPLD,1,12)/Repeat(ADCB_D8)
ADCB_D9: sheet Repeat(ADC,1,12)/Repeat(ADCB_D9), sheet Repeat(CPLD,1,12)/Repeat(ADCB_D9)
ADCB_D10_: sheet Repeat(ADC,1,12)/Repeat(ADCB_D10), sheet Repeat(CPLD,1,12)/Repeat(ADCB_D10)
ADCB_D11_: sheet Repeat(ADC,1,12)/Repeat(ADCB_D11), sheet Repeat(CPLD,1,12)/Repeat(ADCB_D11)
ADCB_VIN_N: sheet Repeat(INT,1,12)/Repeat(ADCB_VIN_N), sheet Repeat(ADC,1,12)/Repeat(ADCB_VIN_N)
ADCB_VIN_P: sheet Repeat(INT,1,12)/Repeat(ADCB_VIN_P), sheet Repeat(ADC,1,12)/Repeat(ADCB_VIN_P)
CFD_OUT: sheet Repeat(CPLD,1,12)/Repeat(CFD_OUT), sheet Repeat(Gate_Strobe,1,12)/Repeat(CFD_OUT)
CPLD_TCK: R124#1.1 R126#1.2 ; port CPLD_TCK, sheet Repeat(CPLD,1,12)/CPLD_TCK
CPLD_TDI: sheet Repeat(CPLD,1,12)/Repeat(CPLD_TDI)
CPLD_TDO: sheet Repeat(CPLD,1,12)/Repeat(CPLD_TDO)
CPLD_TMS: R4.2 R125#1.1 ; port CPLD_TMS, sheet Repeat(CPLD,1,12)/CPLD_TMS
DAC_SYNC: sheet Repeat(QDC,1,12)/Repeat(DAC_SYNC)
DI0_: sheet Repeat(CPLD,1,12)/Repeat(DI0_)
DI1_: sheet Repeat(CPLD,1,12)/Repeat(DI1_)
DI2_: sheet Repeat(CPLD,1,12)/Repeat(DI2_)
DI3_: sheet Repeat(CPLD,1,12)/Repeat(DI3_)
DI4_: sheet Repeat(CPLD,1,12)/Repeat(DI4_)
DI5_: sheet Repeat(CPLD,1,12)/Repeat(DI5_)
DI6_: sheet Repeat(CPLD,1,12)/Repeat(DI6_)
DI7_: sheet Repeat(CPLD,1,12)/Repeat(DI7_)
DI8_: sheet Repeat(CPLD,1,12)/Repeat(DI8_)
DI9_: sheet Repeat(CPLD,1,12)/Repeat(DI9_)
DI10_: sheet Repeat(CPLD,1,12)/Repeat(DI10_)
DI11_: sheet Repeat(CPLD,1,12)/Repeat(DI11_)
DI12_: sheet Repeat(CPLD,1,12)/Repeat(DI12_)
EV_IN_: sheet Repeat(CPLD,1,12)/Repeat(EV_IN_)
EV_OUT_: sheet Repeat(CPLD,1,12)/Repeat(EV_OUT_)
Event_N: sheet Repeat(Gate_Strobe,1,12)/Repeat(Event_N)
Event_P: sheet Repeat(Gate_Strobe,1,12)/Repeat(Event_P)
Gate_STR1_i: sheet Repeat(CPLD,1,12)/Repeat(Gate_STR1_i), sheet Repeat(Gate_Strobe,1,12)/Repeat(Gate_STR1_i)
Gate_STR1_o: sheet Repeat(CPLD,1,12)/Repeat(Gate_STR1_o), sheet Repeat(Gate_Strobe,1,12)/Repeat(Gate_STR1_o)
INTA_G_DRV: sheet Repeat(INT,1,12)/Repeat(INTA_G_DRV), sheet Repeat(CPLD,1,12)/Repeat(INTA_G_DRV)
INTB_G_DRV: sheet Repeat(INT,1,12)/Repeat(INTB_G_DRV), sheet Repeat(CPLD,1,12)/Repeat(INTB_G_DRV), sheet Repeat(ADC_PLL,1,12)/Repeat(INTB_G_DRV)
N5V0_CFD: sheet Repeat(INT,1,12)/Repeat(N5V0_CFD), sheet Repeat(QDC,1,12)/Repeat(N5V0_CFD)
P3V3_QDC: sheet Repeat(ADC,1,12)/Repeat(P3V3_QDC), sheet Repeat(QDC,1,12)/Repeat(P3V3_QDC), sheet Repeat(Gate_Strobe,1,12)/Repeat(P3V3_QDC)
P5V0_CFD: sheet Repeat(INT,1,12)/Repeat(P5V0_CFD), sheet Repeat(QDC,1,12)/Repeat(P5V0_CFD), sheet Repeat(ADC_PLL,1,12)/Repeat(P5V0_CFD)
PLL_CLK0_N: sheet Repeat(ADC_PLL,1,12)/Repeat(PLL_CLK0_N)
PLL_CLK0_P: sheet Repeat(ADC_PLL,1,12)/Repeat(PLL_CLK0_P)
PLL_SPI_CLK: DD31.2(IN) ; port PLL_SPI_CLK
PLL_SPI_MOSI: port PLL_SPI_MOSI, sheet Repeat(QDC,1,12)/PLL_SPI_MOSI
SPI_SCLK_BUF: R163#1.2 ; sheet Repeat(QDC,1,12)/SPI_SCLK_BUF
STR1_: sheet Repeat(CPLD,1,12)/Repeat(STR1_)
VREF_1.024V: sheet Repeat(INT,1,12)/Repeat(VREF_1.024V), sheet Repeat(QDC,1,12)/Repeat(VREF_1.024V)
VREF_2.048V: sheet Repeat(INT,1,12)/Repeat(VREF_2.048V), sheet Repeat(QDC,1,12)/Repeat(VREF_2.048V)
XDA22_A0: sheet Repeat(QDC,1,12)/Repeat(XDA22_A0)
XDA22_A1: sheet Repeat(QDC,1,12)/Repeat(XDA22_A1)
NetDD31_4: DD31.4(OUT) R163#1.1

### Buses and harness runs
bus DI0_[1..12] = port DI0_[1..12]
bus DI1_[1..12] = port DI1_[1..12]
bus DI2_[1..12] = port DI2_[1..12]
bus DI3_[1..12] = port DI3_[1..12]
bus DI4_[1..12] = port DI4_[1..12]
bus DI5_[1..12] = port DI5_[1..12]
bus DI6_[1..12] = port DI6_[1..12]
bus DI7_[1..12] = port DI7_[1..12]
bus DI8_[1..12] = port DI8_[1..12]
bus DI9_[1..12] = port DI9_[1..12]
bus DI10_[1..12] = port DI10_[1..12]
bus DI11_[1..12] = port DI11_[1..12]
bus DI12_[1..12] = port DI12_[1..12]
bus Event_N[1..12] = port Event_N[1..12]
bus Event_P[1..12] = port Event_P[1..12]
bus PLL_CLK0_N[1..12] = port PLL_CLK0_N[1..12]
bus PLL_CLK0_P[1..12] = port PLL_CLK0_P[1..12]
bus STR1_[1..12] = port STR1_[1..12]

### Notes on the sheet
- EVNT daisy chain
- JTAG daisy chain
- Project/Equipment
- Document
- Designer
- Drawn by
- Check.by
- Copyright WUT ISE 2024.
  This documentation describes Open Hardware and is licensed under the CERN OHL v.2. You may redistribute and modify this documentation under the terms of the CERN OHL v.2. (http://ohwr.org/CERNOHL). This documentation is distributed WITHOUT ANY EXPRESS OR IMPLIED WARRANTY, INCLUDING OF MERCHANTABILITY, SATISFACTORY QUALITY AND FITNESS FOR A PARTICULAR PURPOSE. Please see the CERN OHL v.2 for applicable conditions.
- Contact
- File
- Last Mod.
- Print Date
- Sheet
- Size
- A3
- of
- Rev

### Library data of the parts
DD31 = SN74LVC1G17DBVR: Single Schmitt-Trigger Buffer; Manufacturer: TEXAS INSTRUMENTS; PressFit: No; Bonding: No; Part Number: SN74LVC1G17DBVR; Component Kind: Standard; Component Type: Standard; Device: SN74LVC1G17DBV; PackageDescription: SOT, 0.95mm Pitch; 5 Pin, 1.60mm W X 2.90mm L X 1.45mm H body, IPC Medium Density; Part Description: Single Schmitt-Trigger Buffer; Manufacturer Part Number: SN74LVC1G17DBV; Pin Count: 5; Case: SOT23-5; Mounted: Yes; Socket: No; SMD: Yes; Sense: No; ComponentHeight: 1.45mm; Author: CERN DEM JLC; HelpURL: \\cern.ch\dfs\Applications\Altium\Datasheets\SN74LVC1G17DBVR.pdf; CreateDate: 06.11.2012; LatestRevisionDate: 06.11.2012
R4 R124#1 R125#1 R126#1 = R0805_200R_1%_0.125W_100PPM: Resistor - 1%; Part Description: General Purpose Thick Film Chip Resistor; Manufacturer: GENERIC; Manufacturer1 Part Number: NRC10F2000TRF; Power: 0.125W; TC: ±100ppm/°C; PressFit: No; Part Number: R0805_200R_1%_0.125W_100PPM; Component Kind: Standard; Component Type: Standard; Pin Count: 2; Value: 200; Status: Preferred; Manufacturer Part Number: R0805_200R_1%_0.125W_100PPM; Case: 0805; Mounted: Yes; Sense: No; Socket: No; SMD: Yes; Manufacturer1 Example: NIC COMPONENT; Manufacturer1 ComponentHeight: 0.6mm; HelpURL: \\cern.ch\dfs\Applications\Altium\Datasheets\R0805_NIC_NRC.pdf; Author: CERN DEM JLC; CreateDate: 03.12.2007; LatestRevisionDate: 13.03.2008
R163#1 = R0805_20R_1%_0.125W_100PPM: Resistor - 1%; Part Description: General Purpose Thick Film Chip Resistor; Manufacturer: GENERIC; Manufacturer1 Part Number: NRC10F20R0TRF; Power: 0.125W; TC: ±100ppm/°C; PressFit: No; Part Number: R0805_20R_1%_0.125W_100PPM; Component Kind: Standard; Component Type: Standard; Pin Count: 2; Value: 20; Status: Preferred; Manufacturer Part Number: R0805_20R_1%_0.125W_100PPM; Case: 0805; Mounted: Yes; Sense: No; Socket: No; SMD: Yes; Manufacturer1 Example: NIC COMPONENT; Manufacturer1 ComponentHeight: 0.6mm; HelpURL: \\cern.ch\dfs\Applications\Altium\Datasheets\R0805_NIC_NRC.pdf; Author: CERN DEM JLC; CreateDate: 03.12.2007; LatestRevisionDate: 13.03.2008

## Sheet Integrators.SchDoc: FIT_PM12 board
size 420 x 297 mm; CheckedBy: G.Kasprowicz; Author: INR Moscow; CompanyName: WUT ISE; DrawnBy: M.Podgórski; Organization: WUT ISE; Address1: PW ISE; Address2: Nowowiejska 15/19 00-665 Warsaw; Address3: gkasprow@gmail.com; DocumentNumber: 3; Revision: 2; SheetNumber: 7; SheetTotal: 34; ModifiedBy: -; CheckedDate: -; Title2: Integrators; DivGrp: WUT ISE; Designer: INR RAS; ModifiedDate: -; ProjectName: Sensor Box
Used 12 times, as channels AFE/INT1, AFE/INT2, AFE/INT3, AFE/INT4, AFE/INT5, AFE/INT6, AFE/INT7, AFE/INT8, AFE/INT9, AFE/INT10, AFE/INT11, AFE/INT12. Parts and nets are listed once, with the designators drawn on the sheet.
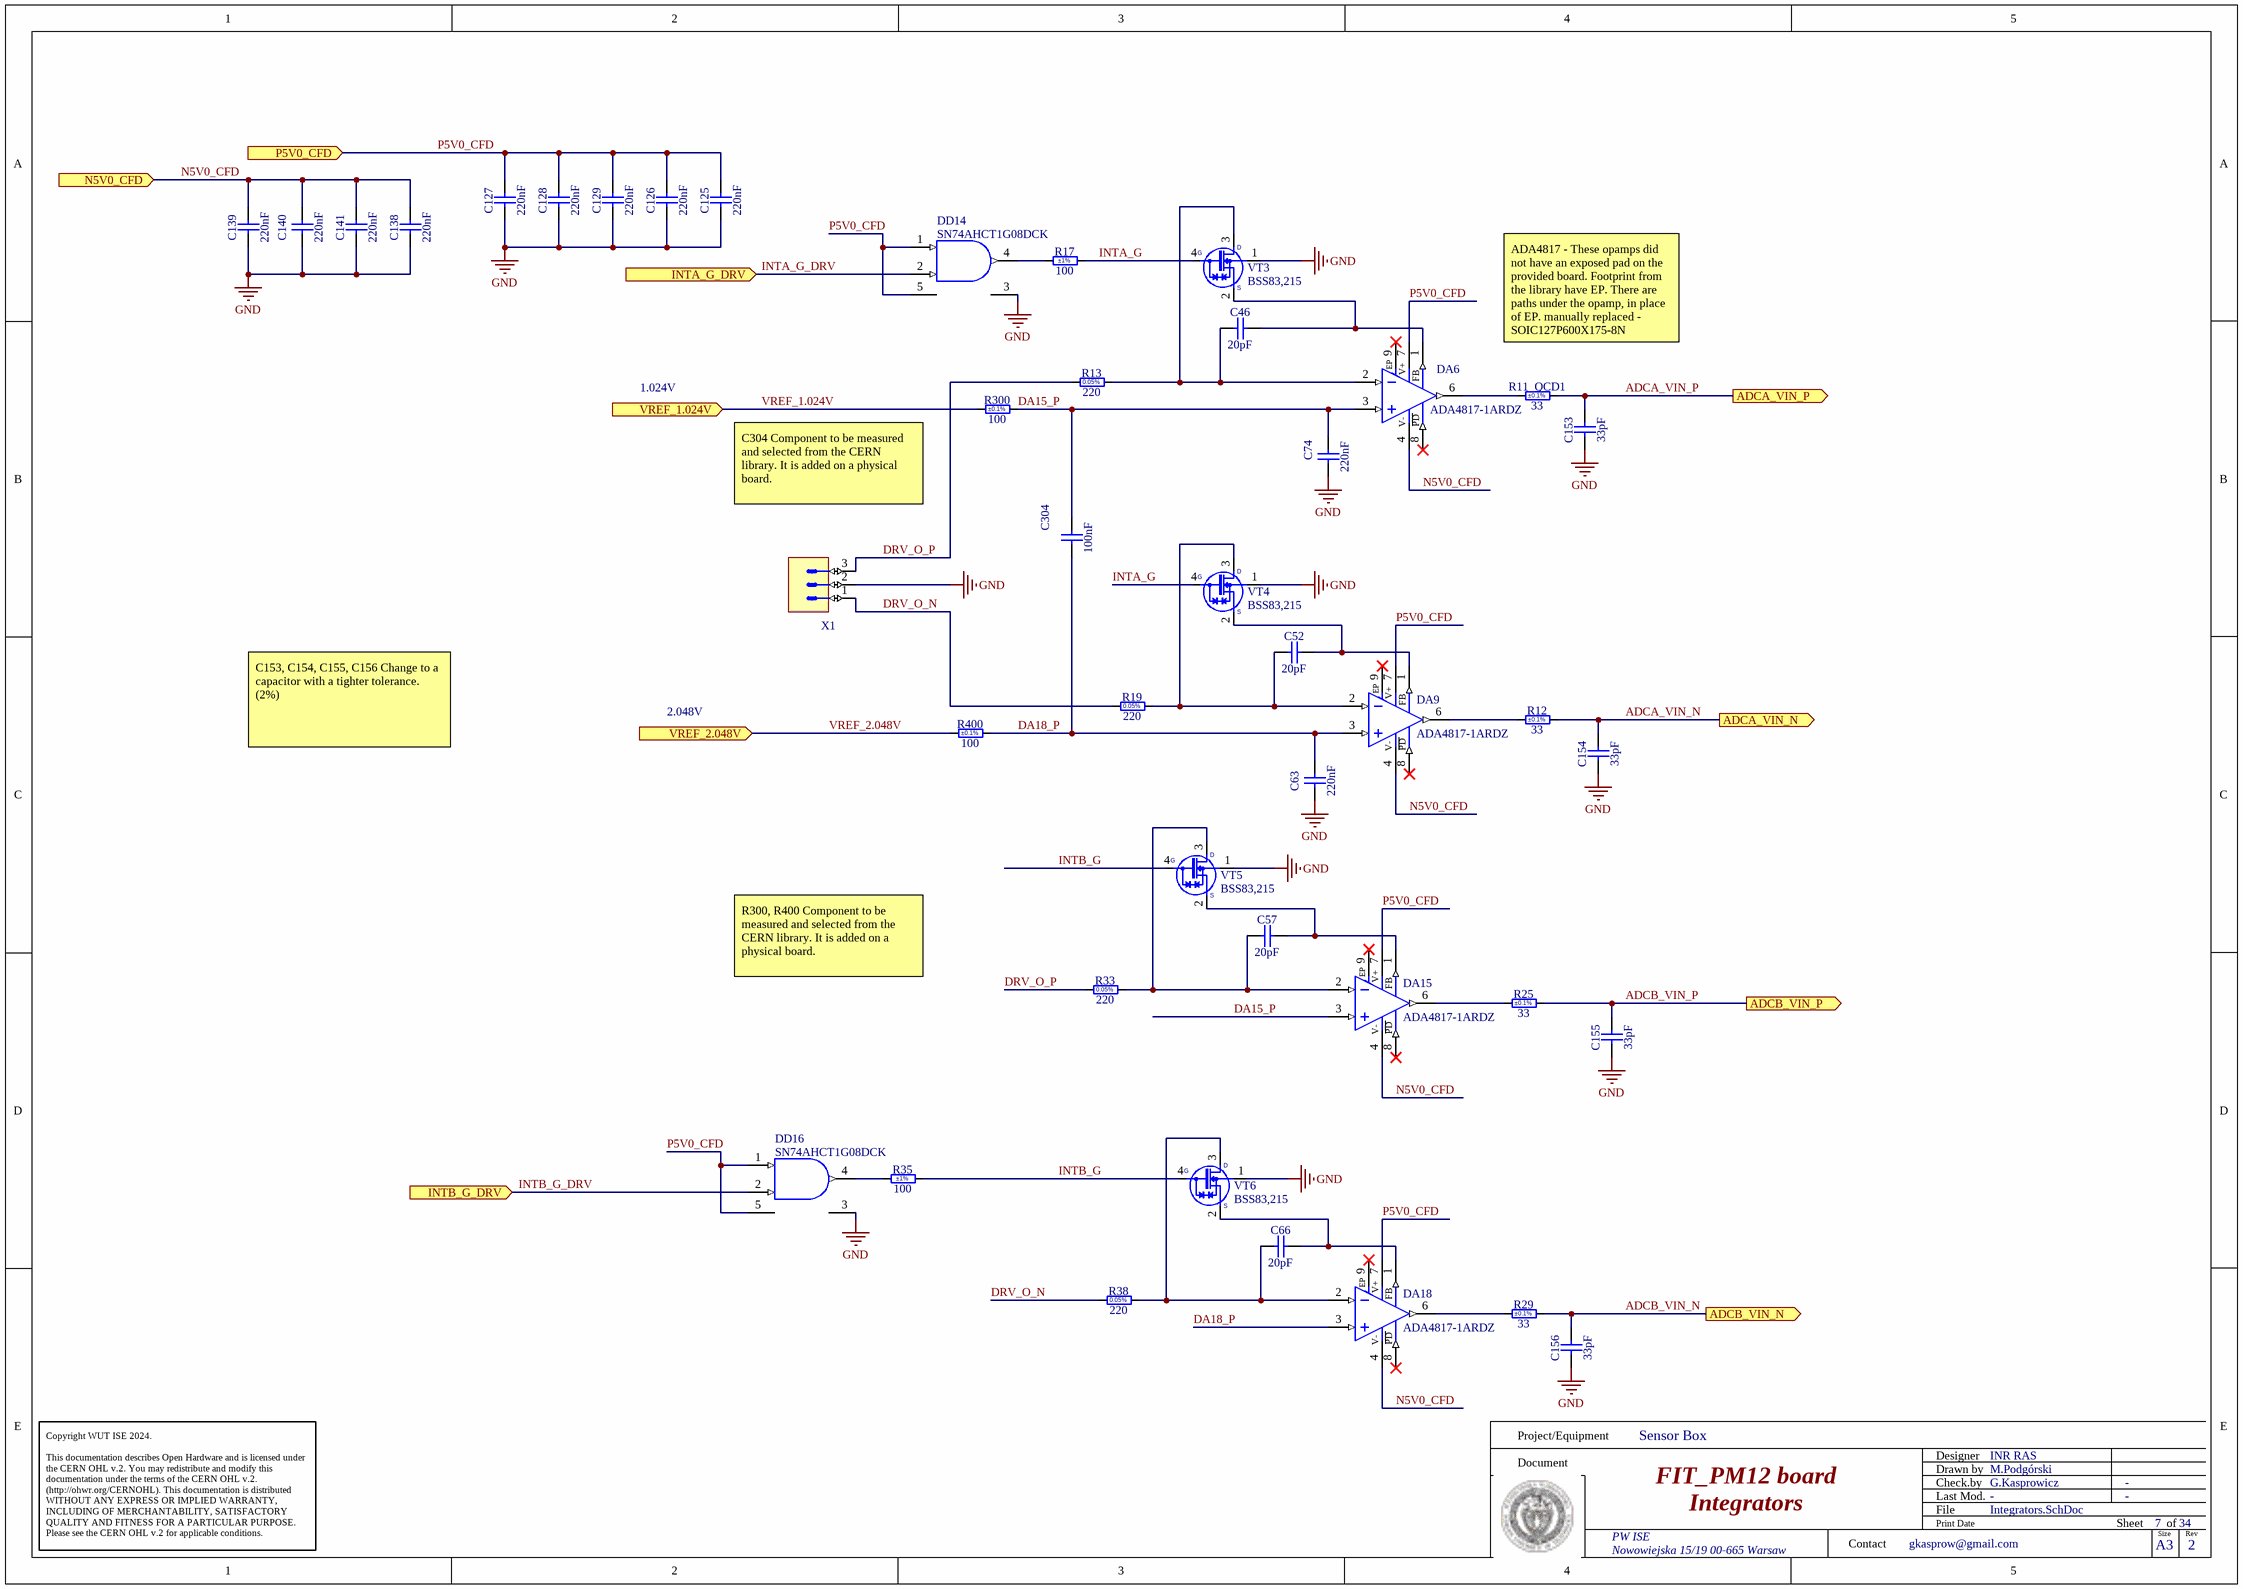
[diagram p28: Integrators.SchDoc]

### Parts
C46  20pF  [CAPC2012X135N]
C52  20pF  [CAPC2012X135N]
C57  20pF  [CAPC2012X135N]
C63  220nF  [CAPC2012X135N]
C66  20pF  [CAPC2012X135N]
C74  220nF  [CAPC2012X135N]
C125  220nF  [CAPC2012X135N]
C126  220nF  [CAPC2012X135N]
C127  220nF  [CAPC2012X135N]
C128  220nF  [CAPC2012X135N]
C129  220nF  [CAPC2012X135N]
C138  220nF  [CAPC2012X135N]
C139  220nF  [CAPC2012X135N]
C140  220nF  [CAPC2012X135N]
C141  220nF  [CAPC2012X135N]
C153  33pF  [CAPC1608X87N]
C154  33pF  [CAPC1608X87N]
C155  33pF  [CAPC1608X87N]
C156  33pF  [CAPC1608X87N]
C304  100nF  [CAPC2012X88N]
DA6  ADA4817-1ARDZ  [SOIC127P600X175-8N]
DA9  ADA4817-1ARDZ  [SOIC127P600X175-8N]
DA15  ADA4817-1ARDZ  [SOIC127P600X175-8N]
DA18  ADA4817-1ARDZ  [SOIC127P600X175-8N]
DD14  SN74AHCT1G08DCK  [SOT65P210X110-5N]
DD16  SN74AHCT1G08DCK  [SOT65P210X110-5N]
R11_QCD1  33  Tolerance: ±0.1%  [RESC1608X64N]
R12  33  Tolerance: ±0.1%  [RESC1608X64N]
R13  220  [RESC2012X60N]
R17  100  Tolerance: ±1%  [RESC1608X55N]
R19  220  [RESC2012X60N]
R25  33  Tolerance: ±0.1%  [RESC1608X64N]
R29  33  Tolerance: ±0.1%  [RESC1608X64N]
R33  220  [RESC2012X60N]
R35  100  Tolerance: ±1%  [RESC1608X55N]
R38  220  [RESC2012X60N]
R300  100  Tolerance: ±0.1%  [RES_VISHAY_FCHP0402]
R400  100  Tolerance: ±0.1%  [RES_VISHAY_FCHP0402]
VT3  BSS83,215  [SOT143N]
VT4  BSS83,215  [SOT143N]
VT5  BSS83,215  [SOT143N]
VT6  BSS83,215  [SOT143N]
X1  Header 3  [SAMTEC_DW-03-09-L-S-470]  (value not drawn)

### Ports
ADCA_VIN_N (out), ADCA_VIN_P (out), ADCB_VIN_N (out), ADCB_VIN_P (out), INTA_G_DRV (in), INTB_G_DRV (in), N5V0_CFD (in), P5V0_CFD (in), VREF_1.024V (in), VREF_2.048V (in)

### Nets
GND: C63.1 C74.1 C125.1 C126.1 C127.1 C128.1 C129.1 C138.1 C139.1 C140.1 C141.1 C153.1 C154.1 C155.1 C156.1 DD14.3(GND) DD16.3(GND) VT3.1(SUB) VT4.1(SUB) VT5.1(SUB) VT6.1(SUB) X1.2
ADCA_VIN_N: C154.2 R12.2 ; port ADCA_VIN_N
ADCA_VIN_P: C153.2 R11_QCD1.2 ; port ADCA_VIN_P
ADCB_VIN_N: C156.2 R29.2 ; port ADCB_VIN_N
ADCB_VIN_P: C155.2 R25.2 ; port ADCB_VIN_P
DA15_P: C74.2 C304.2 DA6.3(IN+) DA15.3(IN+) R300.1
DA18_P: C63.2 C304.1 DA9.3(IN+) DA18.3(IN+) R400.1
DRV_O_N: R19.1 R38.1 X1.1
DRV_O_P: R13.1 R33.1 X1.3
INTA_G: R17.2 VT3.4(G) VT4.4(G)
INTA_G_DRV: DD14.2(A) ; port INTA_G_DRV
INTB_G: R35.2 VT5.4(G) VT6.4(G)
INTB_G_DRV: DD16.2(A) ; port INTB_G_DRV
N5V0_CFD: C138.2 C139.2 C140.2 C141.2 DA6.4(-Vs) DA9.4(-Vs) DA15.4(-Vs) DA18.4(-Vs) ; port N5V0_CFD
P5V0_CFD: C125.2 C126.2 C127.2 C128.2 C129.2 DA6.7(+Vs) DA9.7(+Vs) DA15.7(+Vs) DA18.7(+Vs) DD14.1(B) DD14.5(VCC) DD16.1(B) DD16.5(VCC) ; port P5V0_CFD
VREF_1.024V: R300.2 ; port VREF_1.024V
VREF_2.048V: R400.2 ; port VREF_2.048V
NetC46_1: C46.1 DA6.2(IN-) R13.2 VT3.3(D)
NetC46_2: C46.2 DA6.1(FB) VT3.2(S)
NetC52_1: C52.1 DA9.2(IN-) R19.2 VT4.3(D)
NetC52_2: C52.2 DA9.1(FB) VT4.2(S)
NetC57_1: C57.1 DA15.2(IN-) R33.2 VT5.3(D)
NetC57_2: C57.2 DA15.1(FB) VT5.2(S)
NetC66_1: C66.1 DA18.2(IN-) R38.2 VT6.3(D)
NetC66_2: C66.2 DA18.1(FB) VT6.2(S)
NetDA6_6: DA6.6(OUT) R11_QCD1.1
NetDA9_6: DA9.6(OUT) R12.1
NetDA15_6: DA15.6(OUT) R25.1
NetDA18_6: DA18.6(OUT) R29.1
NetDD14_4: DD14.4(Y) R17.1
NetDD16_4: DD16.4(Y) R35.1

Not connected (* = marked no-connect by the designer): DA6 8(~{PD})* 9(EP)*; DA9 8(~{PD})* 9(EP)*; DA15 8(~{PD})* 9(EP)*; DA18 8(~{PD})* 9(EP)*

### Channels
AFE/INT1: designators end in A; ports ADCA_VIN_N=ADCA_VIN_N ADCA_VIN_P=ADCA_VIN_P ADCB_VIN_N=ADCB_VIN_N ADCB_VIN_P=ADCB_VIN_P INTA_G_DRV=INTA_G_DRV INTB_G_DRV=INTB_G_DRV N5V0_CFD=N5V0_CFD P5V0_CFD=P5V0_CFD VREF_1.024V=VREF_1.024V VREF_2.048V=VREF_2.048V
AFE/INT2: designators end in B; ports ADCA_VIN_N=ADCA_VIN_N ADCA_VIN_P=ADCA_VIN_P ADCB_VIN_N=ADCB_VIN_N ADCB_VIN_P=ADCB_VIN_P INTA_G_DRV=INTA_G_DRV INTB_G_DRV=INTB_G_DRV N5V0_CFD=N5V0_CFD P5V0_CFD=P5V0_CFD VREF_1.024V=VREF_1.024V VREF_2.048V=VREF_2.048V
AFE/INT3: designators end in C; ports ADCA_VIN_N=ADCA_VIN_N ADCA_VIN_P=ADCA_VIN_P ADCB_VIN_N=ADCB_VIN_N ADCB_VIN_P=ADCB_VIN_P INTA_G_DRV=INTA_G_DRV INTB_G_DRV=INTB_G_DRV N5V0_CFD=N5V0_CFD P5V0_CFD=P5V0_CFD VREF_1.024V=VREF_1.024V VREF_2.048V=VREF_2.048V
AFE/INT4: designators end in D; ports ADCA_VIN_N=ADCA_VIN_N ADCA_VIN_P=ADCA_VIN_P ADCB_VIN_N=ADCB_VIN_N ADCB_VIN_P=ADCB_VIN_P INTA_G_DRV=INTA_G_DRV INTB_G_DRV=INTB_G_DRV N5V0_CFD=N5V0_CFD P5V0_CFD=P5V0_CFD VREF_1.024V=VREF_1.024V VREF_2.048V=VREF_2.048V
AFE/INT5: designators end in E; ports ADCA_VIN_N=ADCA_VIN_N ADCA_VIN_P=ADCA_VIN_P ADCB_VIN_N=ADCB_VIN_N ADCB_VIN_P=ADCB_VIN_P INTA_G_DRV=INTA_G_DRV INTB_G_DRV=INTB_G_DRV N5V0_CFD=N5V0_CFD P5V0_CFD=P5V0_CFD VREF_1.024V=VREF_1.024V VREF_2.048V=VREF_2.048V
AFE/INT6: designators end in F; ports ADCA_VIN_N=ADCA_VIN_N ADCA_VIN_P=ADCA_VIN_P ADCB_VIN_N=ADCB_VIN_N ADCB_VIN_P=ADCB_VIN_P INTA_G_DRV=INTA_G_DRV INTB_G_DRV=INTB_G_DRV N5V0_CFD=N5V0_CFD P5V0_CFD=P5V0_CFD VREF_1.024V=VREF_1.024V VREF_2.048V=VREF_2.048V
AFE/INT7: designators end in G; ports ADCA_VIN_N=ADCA_VIN_N ADCA_VIN_P=ADCA_VIN_P ADCB_VIN_N=ADCB_VIN_N ADCB_VIN_P=ADCB_VIN_P INTA_G_DRV=INTA_G_DRV INTB_G_DRV=INTB_G_DRV N5V0_CFD=N5V0_CFD P5V0_CFD=P5V0_CFD VREF_1.024V=VREF_1.024V VREF_2.048V=VREF_2.048V
AFE/INT8: designators end in H; ports ADCA_VIN_N=ADCA_VIN_N ADCA_VIN_P=ADCA_VIN_P ADCB_VIN_N=ADCB_VIN_N ADCB_VIN_P=ADCB_VIN_P INTA_G_DRV=INTA_G_DRV INTB_G_DRV=INTB_G_DRV N5V0_CFD=N5V0_CFD P5V0_CFD=P5V0_CFD VREF_1.024V=VREF_1.024V VREF_2.048V=VREF_2.048V
AFE/INT9: designators end in I; ports ADCA_VIN_N=ADCA_VIN_N ADCA_VIN_P=ADCA_VIN_P ADCB_VIN_N=ADCB_VIN_N ADCB_VIN_P=ADCB_VIN_P INTA_G_DRV=INTA_G_DRV INTB_G_DRV=INTB_G_DRV N5V0_CFD=N5V0_CFD P5V0_CFD=P5V0_CFD VREF_1.024V=VREF_1.024V VREF_2.048V=VREF_2.048V
AFE/INT10: designators end in J; ports ADCA_VIN_N=ADCA_VIN_N ADCA_VIN_P=ADCA_VIN_P ADCB_VIN_N=ADCB_VIN_N ADCB_VIN_P=ADCB_VIN_P INTA_G_DRV=INTA_G_DRV INTB_G_DRV=INTB_G_DRV N5V0_CFD=N5V0_CFD P5V0_CFD=P5V0_CFD VREF_1.024V=VREF_1.024V VREF_2.048V=VREF_2.048V
AFE/INT11: designators end in K; ports ADCA_VIN_N=ADCA_VIN_N ADCA_VIN_P=ADCA_VIN_P ADCB_VIN_N=ADCB_VIN_N ADCB_VIN_P=ADCB_VIN_P INTA_G_DRV=INTA_G_DRV INTB_G_DRV=INTB_G_DRV N5V0_CFD=N5V0_CFD P5V0_CFD=P5V0_CFD VREF_1.024V=VREF_1.024V VREF_2.048V=VREF_2.048V
AFE/INT12: designators end in L; ports ADCA_VIN_N=ADCA_VIN_N ADCA_VIN_P=ADCA_VIN_P ADCB_VIN_N=ADCB_VIN_N ADCB_VIN_P=ADCB_VIN_P INTA_G_DRV=INTA_G_DRV INTB_G_DRV=INTB_G_DRV N5V0_CFD=N5V0_CFD P5V0_CFD=P5V0_CFD VREF_1.024V=VREF_1.024V VREF_2.048V=VREF_2.048V

### Notes on the sheet
- 1.024V
- ADA4817 - These opamps did not have an exposed pad on the provided board. Footprint from the library have EP. There are paths under the opamp, in place of EP. manually replaced - SOIC127P600X175-8N
- C304 Component to be measured and selected from the CERN library. It is added on a physical board.
- 2.048V
- C153, C154, C155, C156 Change to a capacitor with a tighter tolerance. (2%)
- R300, R400 Component to be measured and selected from the CERN library. It is added on a physical board.
- Project/Equipment
- Document
- Designer
- Drawn by
- Check.by
- Copyright WUT ISE 2024.
  This documentation describes Open Hardware and is licensed under the CERN OHL v.2. You may redistribute and modify this documentation under the terms of the CERN OHL v.2. (http://ohwr.org/CERNOHL). This documentation is distributed WITHOUT ANY EXPRESS OR IMPLIED WARRANTY, INCLUDING OF MERCHANTABILITY, SATISFACTORY QUALITY AND FITNESS FOR A PARTICULAR PURPOSE. Please see the CERN OHL v.2 for applicable conditions.
- Contact
- File
- Last Mod.
- Print Date
- Sheet
- Size
- A3
- of
- Rev
- (in symbol ADA4817-1ARDZ) V+; PD; V-
- (in symbol R0805_220R_0.05%_0.125W_10PPM) 0.05%

### Library data of the parts
C46 C52 C57 C66 = CC0805_20PF_50V_2%_C0G: Non-polarised capacitor; Part Description: SMD Multilayer Chip Ceramic Capacitor; Manufacturer: GENERIC; Manufacturer1 Part Number: CC0805GRNPO9BN200; Voltage: 50V; TC: C0G/NP0; Tolerance: ±2%; Part Number: CC0805_20PF_50V_2%_C0G; Component Kind: Standard; Component Type: Standard; Pin Count: 2; Value: 20pF; Status: None; Manufacturer Part Number: CC0805_20PF_50V_2%_C0G; Case: 0805; Mounted: Yes; Socket: No; SMD: Yes; Sense: No; Manufacturer1 Example: YAGEO PHYCOMP; Manufacturer1 ComponentHeight: 1.45mm; HelpURL: \\cern.ch\dfs\Applications\Altium\Datasheets\CC0805_NP0_YAGEO.pdf; Author: CERN DEM HF; CreateDate: 07.05.2024; LatestRevisionDate: 07.05.2024
C63 C74 C125-C129 C138-C141 = CC0805_220NF_50V_10%_X7R: as C215 on sheet JTAG; Part Number: CC0805_220NF_50V_10%_X7R; Component Kind: Standard; Component Type: Standard; Pin Count: 2; Value: 220nF; Status: Preferred; Manufacturer Part Number: CC0805_220NF_50V_10%_X7R; Case: 0805; Mounted: Yes; Socket: No; SMD: Yes; Sense: No; Manufacturer1 Example: MURATA; Manufacturer1 ComponentHeight: 1.35mm; HelpURL: \\cern.ch\dfs\Applications\Altium\Datasheets\CC0805_X7R_MURATA.pdf; Author: CERN DEM JLC; CreateDate: 03.12.2007; LatestRevisionDate: 03.12.2007
C153-C156 = CC0603_33PF_50V_5%_NP0: Non-polarised capacitor; Part Description: SMD Multilayer Chip Ceramic Capacitor; Manufacturer: GENERIC; Manufacturer1 Part Number: 223886715339; Voltage: 50V; TC: C0G/NP0; Tolerance: ±5%; Part Number: CC0603_33PF_50V_5%_NP0; Component Kind: Standard; Component Type: Standard; Pin Count: 2; Value: 33pF; Status: Preferred; Manufacturer Part Number: CC0603_33PF_50V_5%_NP0; Case: 0603; Mounted: Yes; Socket: No; SMD: Yes; Sense: No; Manufacturer1 Example: PHYCOMP; Manufacturer1 ComponentHeight: 0.87mm; HelpURL: \\cern.ch\dfs\Applications\Altium\Datasheets\CC0603_NP0_PHYCOMP.pdf; Author: CERN DEM JLC; CreateDate: 03.12.2007; LatestRevisionDate: 03.12.2007
C304 = CC0805_100NF_50V_1%_NP0: Non-polarised capacitor; Part Description: SMD Multilayer Chip Ceramic Capacitor; Manufacturer: GENERIC; Manufacturer1 Part Number: 0805N103F500C; Voltage: 50V; TC: C0G/NP0; Tolerance: ±1%; Part Number: CC0805_100NF_50V_1%_NP0; Component Kind: Standard; Component Type: Standard; Footprint: CAPC2012X135N; Pin Count: 2; Value: 100nF; Status: Not Recommended; Manufacturer Part Number: CC0805_100NF_50V_1%_NP0; Case: 0805; Mounted: Yes; Socket: No; SMD: Yes; Sense: No; ComponentHeight: 1.35mm; Manufacturer1 Example: WALSIN TECHNOLOGY CORPORATION; Manufacturer1 ComponentHeight: 1.35mm; HelpURL: \\cern.ch\dfs\Applications\Altium\Datasheets\CC0805_WALSIN_0805.pdf; Author: CERN DEM HF; CreateDate: 28.08.2023; LatestRevisionDate: 28.08.2023
DA6 DA9 DA15 DA18 = ADA4817-1ARDZ: Low Noise, 1GHz FastFEET Operational Amplifier; Part Description: Low Noise, 1GHz FastFET Operational Amplifier; Manufacturer: ANALOG DEVICES; PressFit: No; Bonding: No; Part Number: ADA4817-1ARDZ; Component Kind: Standard; Component Type: Standard; Device: ADA4817-1ARDZ; Footprint: SOIC127P600X175-9N-S229; PackageDescription: SOIC, 1.27mm Pitch; 8 Pin, 3.90mm W X 4.90mm L X 1.75mm H body (w/Thermal Tab 2.29 X 2.29mm), IPC Medium Density; Manufacturer Part Number: ADA4817-1ARD; Pin Count: 9; Case: SOIC8; Mounted: Yes; Socket: No; SMD: Yes; Sense: No; ComponentHeight: 1.75mm; Author: CERN DEM JLC; HelpURL: \\cern.ch\dfs\Applications\Altium\Datasheets\ADA4817-1ARDZ.pdf; CreateDate: 20.09.2017; LatestRevisionDate: 31.03.2022
DD14 DD16 = SN74AHCT1G08DCK: Single 2-Input AND Gate; Part Description: Single 2-Input Positive-AND Gate; Manufacturer: TEXAS INSTRUMENTS; PressFit: No; Bonding: No; Part Number: SN74AHCT1G08DCK; Component Kind: Standard; Component Type: Standard; Device: SN74AHCT1G08DCK; PackageDescription: SOT353, SC70-5, 0.65mm Pitch; 5 Pin, 1.25mm W X 2.00mm L X 1.10mm H body, IPC Medium Density; Manufacturer Part Number: SN74AHCT1G08DCK; Pin Count: 5; Case: SOT353; Mounted: Yes; Socket: No; SMD: Yes; Sense: No; ComponentHeight: 1.1mm; Author: CERN DEM HF; HelpURL: \\cern.ch\dfs\Applications\Altium\Datasheets\NC7SZ08.pdf; CreateDate: 17.05.2024; LatestRevisionDate: 17.05.2024
R11_QCD1 R12 R25 R29 = R0603_33R_0.1%_0.1W_10PPM: Resistor - 0.1%; Part Description: Thin Film Chip Resistor; Manufacturer: GENERIC; Manufacturer1 Part Number: RT0603BRD0733RL; Power: 0.1W; TC: ±10ppm/°C; PressFit: No; Part Number: R0603_33R_0.1%_0.1W_10PPM; Component Kind: Standard; Component Type: Standard; Pin Count: 2; Value: 33; Status: Not Recommended; Manufacturer Part Number: R0603_33R_0.1%_0.1W_10PPM; Case: 0603; Mounted: Yes; Sense: No; Socket: No; SMD: Yes; Manufacturer1 Example: YAGEO; Manufacturer1 ComponentHeight: 0.55mm; HelpURL: \\cern.ch\dfs\Applications\Altium\Datasheets\R0603_YAGEO_RT.pdf; Author: CERN DEM HF; CreateDate: 17.05.2024; LatestRevisionDate: 17.05.2024
R13 R19 R33 R38 = R0805_220R_0.05%_0.125W_10PPM: Resistor - 0.05%; Part Description: Thin Film Chip Resistor; Manufacturer: GENERIC; Manufacturer1 Part Number: RG2012N-221-W-T1; Power: 0.125W; TC: ±10ppm/°C; PressFit: No; Part Number: R0805_220R_0.05%_0.125W_10PPM; Component Kind: Standard; Component Type: Standard; Pin Count: 2; Value: 220; Status: Not Recommended; Tolerance: ±0.05%; Manufacturer Part Number: R0805_220R_0.05%_0.125W_10PPM; Case: 0805; Mounted: Yes; Sense: No; Socket: No; SMD: Yes; Manufacturer1 Example: SUSUMU; Manufacturer1 ComponentHeight: 0.5mm; HelpURL: \\cern.ch\dfs\Applications\Altium\Datasheets\R0805_SUSUMU_RG.pdf; Author: CERN DEM HF; CreateDate: 17.05.2024; LatestRevisionDate: 17.05.2024
R17 R35 = R0603_100R_1%_0.1W_100PPM: Resistor - 1%; Part Description: General Purpose Thick Film Chip Resistor; Manufacturer: GENERIC; Manufacturer1 Part Number: NRC06F4700TRF; Power: 0.1W; TC: ±100ppm/°C; PressFit: No; Part Number: R0603_100R_1%_0.1W_100PPM; Component Kind: Standard; Component Type: Standard; Pin Count: 2; Value: 100; Status: Preferred; Manufacturer Part Number: R0603_100R_1%_0.1W_100PPM; Case: 0603; Mounted: Yes; Sense: No; Socket: No; SMD: Yes; Manufacturer1 Example: NIC COMPONENT; Manufacturer1 ComponentHeight: 0.55mm; HelpURL: \\cern.ch\dfs\Applications\Altium\Datasheets\R0603_NIC_NRC.pdf; Author: CERN DEM JLC; CreateDate: 03.12.2007; LatestRevisionDate: 13.03.2008
R300 R400 = R0402_100R_0.1%_1W_25PPM_VISHAY_FCHP0402E1000BS: Resistor - 0.1%; Part Description: High Frequency 60 GHz High Power 1 W Thin Film Surface Mount Chip Resistor; Manufacturer: VISHAY; Power: 1W; TC: ±25ppm/°C; PressFit: No; Part Number: R0402_100R_0.1%_1W_25PPM_VISHAY_FCHP0402E1000BS; Component Kind: Standard; Component Type: Standard; Pin Count: 2; Value: 100; Status: Not Recommended; Manufacturer Part Number: FCHP0402E1000BS; Case: 0402; Mounted: Yes; Sense: No; Socket: No; SMD: Yes; ComponentHeight: 0.38mm; HelpURL: \\cern.ch\dfs\Applications\Altium\Datasheets\R0402_VISHAY_FCHP.pdf; Author: CERN DEM HF; CreateDate: 04.04.2023; LatestRevisionDate: 04.04.2023
VT3-VT6 = BSS83,215: 10V, 50 mA N-Channel Enhancement Switching Transistor; Part Description: 10V, 50mA, N-Channel Enhancement Switching Transistor; Manufacturer: NXP SEMICONDUCTORS; PressFit: No; Bonding: No; Part Number: BSS83,215; Component Kind: Standard; Component Type: Standard; Device: BSS83,215; PackageDescription: SOT143, 4-Leads, Body 3.0x2.6mm (max), Pitch 1.92mm, IPC Medium Density; Status: Obsolete; Manufacturer Part Number: BSS83,215; Pin Count: 4; Case: SOT143; Mounted: Yes; Socket: No; SMD: Yes; Sense: No; ComponentHeight: 1.3mm; HelpURL: \\cern.ch\dfs\Applications\Altium\Datasheets\BSS83,215.pdf; Author: CERN DEM JLC; CreateDate: 01.07.2014; LatestRevisionDate: 17.05.2016
X1 = SAMTEC_DW-03-09-L-S-470: Connector 3 Male; Part Description: 3 Contacts, Pitch 2.54mm, Single Row Straight .Flex Stack, Flexible Board Stacker (Stacker Height = 11,938mm); Manufacturer: SAMTEC; PressFit: No; Part Number: SAMTEC_DW-03-09-L-S-470; Component Kind: Standard; Component Type: Standard; Pin Count: 3; Family: Header 3; Mounted: Yes; Socket: No; SMD: No; Sense: No; Status: None; Manufacturer Part Number: DW-03-09-L-S-470; ComponentHeight: 15.75mm; HelpURL: \\cern.ch\dfs\Applications\Altium\Datasheets\SAMTEC_DW.pdf; Author: CERN DEM HF; CreateDate: 06.06.2024; LatestRevisionDate: 06.06.2024